# Altium schematic sheet [02] - BLOCK DIAGRAM.SchDoc: BLOCK DIAGRAM
size A4; Organization: Bjørn T. Brodtkorb; Address1: Frode Rinnans veg 161; Address2: 7050 Trondheim; DocumentNumber: 6598; Revision: 1.0; SheetNumber: 1; SheetTotal: 1
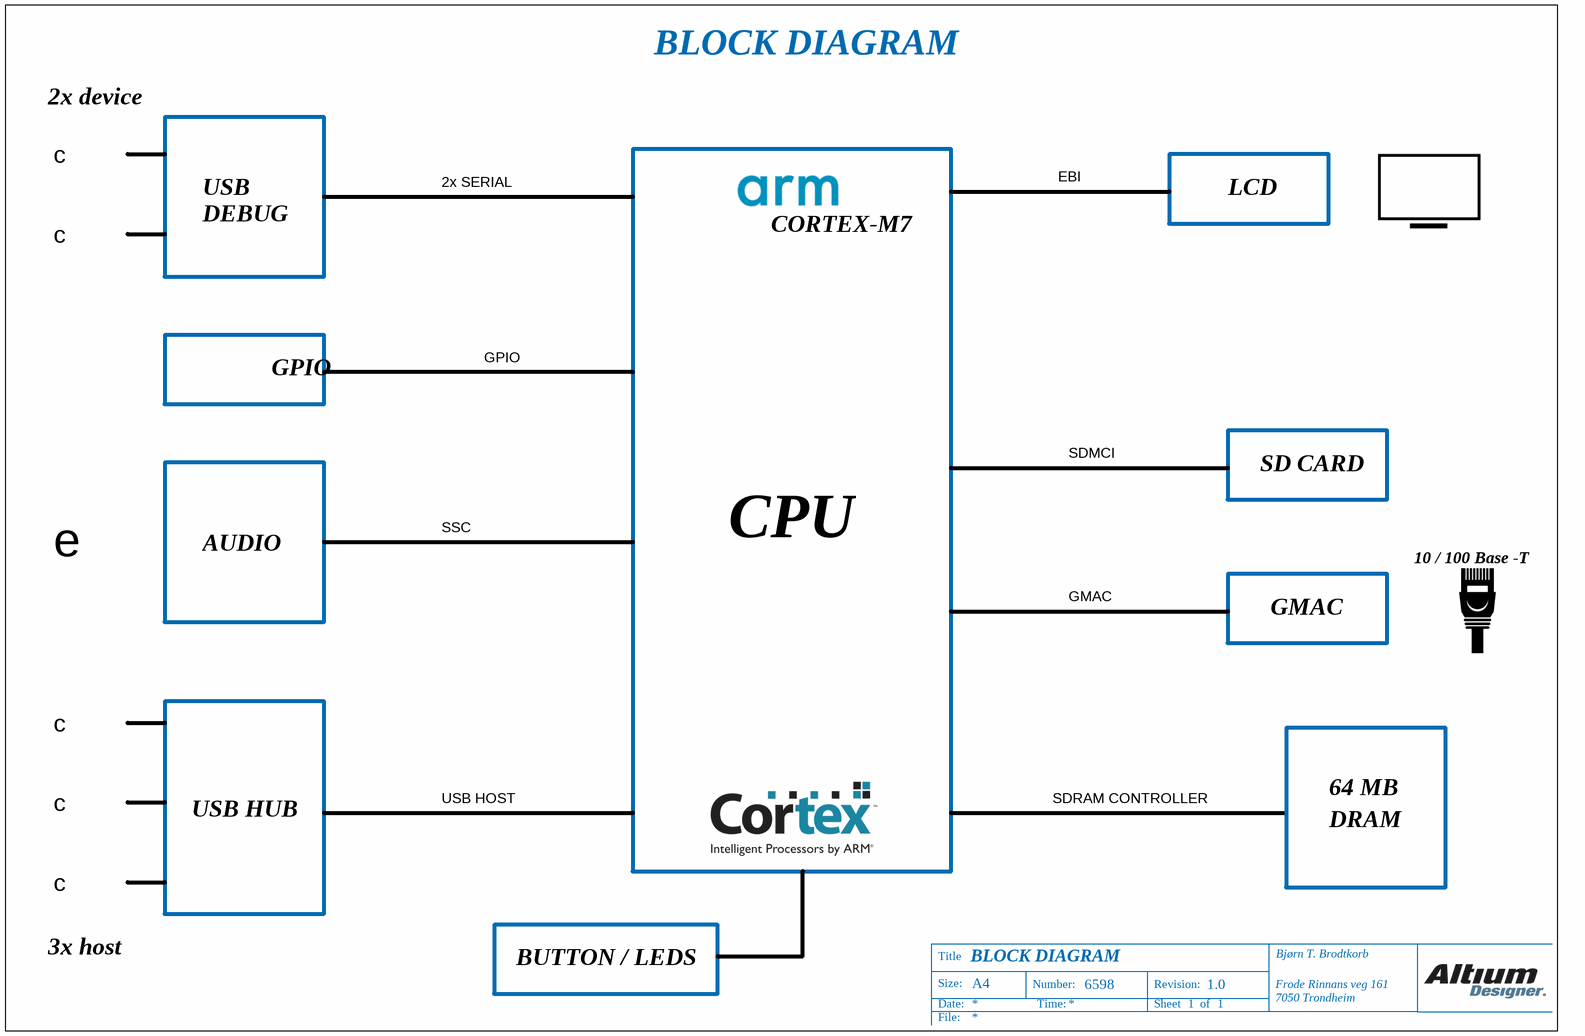
[diagram p0: [02] - BLOCK DIAGRAM.SchDoc]

## Notes on the sheet
- 2x device
- BLOCK DIAGRAM
- c
- EBI
- DEBUG
- USB
- 2x SERIAL
- CORTEX-M7
- LCD
- GPIO
- SDMCI
- SD CARD
- e
- AUDIO
- SSC
- CPU
- 10 / 100 Base -T
- GMAC
- USB HUB
- USB HOST
- SDRAM CONTROLLER
- DRAM
- 64 MB
- 3x host
- BUTTON / LEDS
- Title
- Size:
- A4
- Number:
- Revision:
- Date:
- File:
- Time:
- Sheet
- of